# EAGLE design codeshield_complete (EAGLE 5.07)
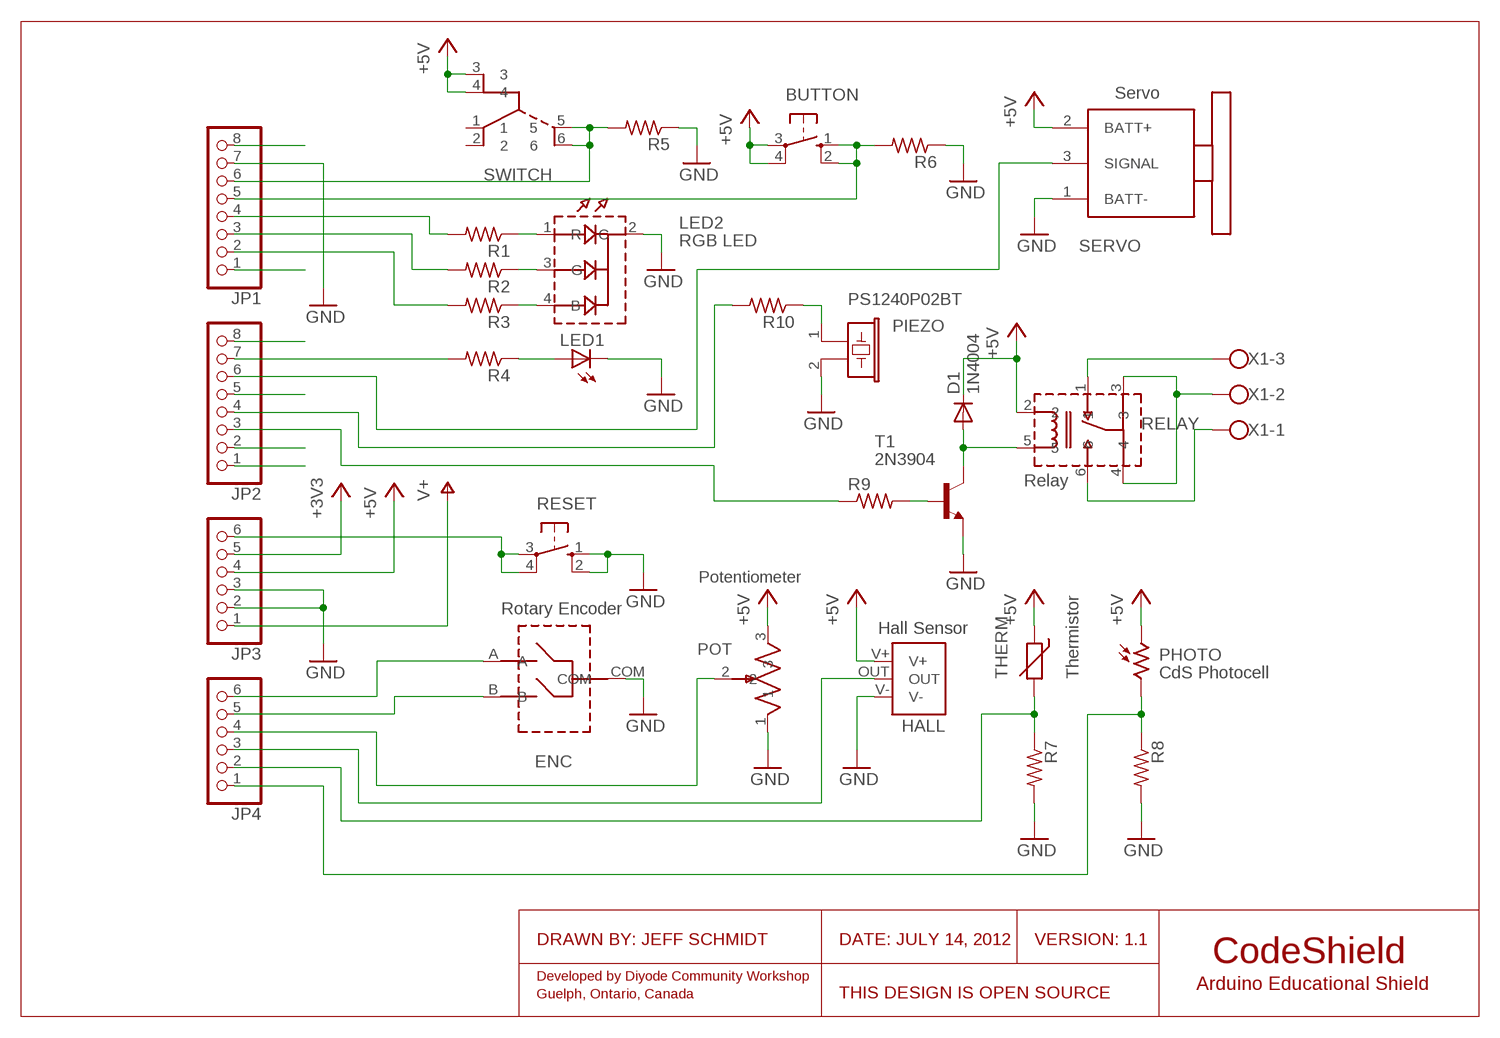
[diagram p0: schematic, sheet 1]

## Parts
BUTTON  10-XX  [B3F-10XX]
D1  1N4004  [DO41-10]
ENC  EVE_ROTARY_ENCODER  [12MM_ENCODER]
HALL  SS49E  [TO_92_SHORT]
JP1  PINHD-1X8  [1X08]
JP2  PINHD-1X8  [1X08]
JP3  PINHD-1X6  [1X06]
JP4  PINHD-1X6  [1X06]
LED1  LED5MM  [LED5MM]
LED2  RGB LED  RGBLED_COMMON_CATHODE  [RGB_VERTICAL]
PHOTO  CdS Photocell  VT20N1  [TO46-VT200]
PIEZO  PS1240P02BT  [PS1240P02BT]
POT  EVU_POTENTIOMETER  [VERT_POT]
R1  R-US_0207/10  [0207/10]
R2  R-US_0207/10  [0207/10]
R3  R-US_0207/10  [0207/10]
R4  R-US_0207/10  [0207/10]
R5  R-US_0207/10  [0207/10]
R6  R-US_0207/10  [0207/10]
R7  R-US_0207/10  [0207/10]
R8  R-US_0207/10  [0207/10]
R9  R-US_0207/10  [0207/10]
R10  R-US_0207/10  [0207/10]
RELAY  TSC_1FORMC  [TSC_RELAY]
RESET  10-XX  [B3F-10XX]
SERVO  SG90_SERVO  [SG90_SERVO]
SWITCH  MHSS_MICROSLIDE  [SLIDE_SWITCH]
T1  2N3904  [TO92]
THERM  Thermistor  THERMISTOR-5  [R-5]
X1  W237-103  [W237-103]

## Nets
+3V3: JP3.5
+5V: BUTTON.3(P) BUTTON.4(P1) D1.C HALL.V+ JP3.4 PHOTO.1 POT.3 RELAY.2 SERVO.2(BATT+) SWITCH.3 SWITCH.4 THERM.1
BLUE: JP1.3 R2.2
BUTTON: BUTTON.1(S) BUTTON.2(S1) JP1.5 R6.2
GND: ENC.COM HALL.V- JP1.7 JP3.2 JP3.3 LED1.K(C) LED2.2(C) PIEZO.2 POT.1 R5.1 R6.1 R7.2 R8.2 RESET.1(S) RESET.2(S1) SERVO.1(BATT-) T1.3(E)
GREEN: JP1.2 R3.2
HALL_SENSOR: HALL.OUT JP4.3
LED: JP2.7 R4.2
N$1: LED2.1(R) R1.1
N$2: LED2.3(G) R2.1
N$3: LED2.4(B) R3.1
N$4: PIEZO.1 R10.1
N$5: JP1.8
N$6: D1.A RELAY.5 T1.1(C)
N$7: LED1.A R4.1
N$9: RELAY.1 X1.3
N$10: RELAY.3 RELAY.4 X1.2
N$12: RELAY.6 X1.1
N$13: R9.2 T1.2(B)
PHOTOCELL: JP4.1 PHOTO.2 R8.1
PIEZO: JP2.4 R10.2
POTENTIOMETER: JP4.4 POT.2
RED: JP1.4 R1.2
RELAY: JP2.3 R9.1
RESET: JP3.6 RESET.3(P) RESET.4(P1)
ROTARY_A: ENC.A JP4.6
ROTARY_B: ENC.B JP4.5
SERVO: JP2.6 SERVO.3(SIGNAL)
SWITCH: JP1.6 R5.2 SWITCH.5 SWITCH.6
THERMISTOR: JP4.2 R7.1 THERM.2
UNUSED1: JP1.1
UNUSED2: JP2.8
UNUSED3: JP2.5
UNUSED4: JP2.2
UNUSED5: JP2.1
V+: JP3.1
Unconnected: SWITCH.1 SWITCH.2

## Notes on the sheet
- Servo
- Relay
- Potentiometer
- Rotary Encoder
- Hall Sensor
- DRAWN BY: JEFF SCHMIDT | DATE: JULY 14, 2012 | VERSION: 1.1
- CodeShield
- Developed by Diyode Community Workshop
- Arduino Educational Shield
- Guelph, Ontario, Canada | THIS DESIGN IS OPEN SOURCE

## Library data of the parts
BUTTON RESET = switch-omron:10-XX: OMRON SWITCH
D1 = diode:1N4004: DIODE general purpose rectifier, 1 A
ENC = CodeShield Parts:EVE_ROTARY_ENCODER: Panasonic EVE-series rotary encoder 12mm body, 6mm flatted end shaft Quadrature output With Detents 12 pulses per revolution
HALL = CodeShield Parts:SS49E: Honeywell SS49E series Hall Effect Sensor Sensing range: 1mV/G ~ 1.75mV/G Type: Linear Voltage: 2.7V - 6.5V Supply Current: 10mA Output: Analog
JP1 JP2 = pinhead:PINHD-1X8: PIN HEADER
JP3 JP4 = pinhead:PINHD-1X6: PIN HEADER
LED1 = led:LED: LED OSRAM: - CHIPLED LG R971, LG N971, LY N971, LG Q971, LY Q971, LO R971, LY R971 LH N974, LH R974 LS Q976, LO Q976, LY Q976 LO Q996 - Hyper CHIPLED LW Q18S LB Q993, LB Q99A, LB R99A - SideLED LS A670, LO A670, LY A670, LG A670, LP A670 LB A673, LV A673, LT A673, LW A673 LH A674 LY A675 LS A676, LA A676, LO A676, LY A676, LW A676 LS A679, LY A679, LG A679 - Hyper Micro SIDELED® LS Y876, LA Y876, LO Y876, LY Y876 LT Y87S - SmartLED LW L88C, LW L88S LB L89C, LB L89S, LG L890 LS L89K, LO L89K, LY L89K LS L896, LA L896, LO L896, LY L896 - TOPLED LS T670, LO T670, LY T670, LG T670, LP T670 LSG T670, LSP T670, LSY T670, LOP T670, LYG T670 LG T671, LOG T671, LSG T671 LB T673, LV T673, LT T673, LW T673 LH T674 LS T676, LA T676, LO T676, LY T676, LB T676, LH T676, LSB T676, LW T676 LB T67C, LV T67C, LT T67C, LS T67K, LO T67K, LY T67K, LW E67C LS E67B, LA E67B, LO E67B, LY E67B, LB E67C, LV E67C, LT E67C LW T67C LS T679, LY T679, LG T679 LS T770, LO T770, LY T770, LG T770, LP T770 LB T773, LV T773, LT T773, LW T773 LH T774 LS E675, LA E675, LY E675, LS T675 LS T776, LA T776, LO T776, LY T776, LB T776 LHGB T686 LT T68C, LB T68C - Hyper Mini TOPLED® LB M676 - Mini TOPLED Santana® LG M470 LS M47K, LO M47K, LY M47K Source: http://www.osram.convergy.de LUXEON: - LUMILED® LXK2-PW12-R00, LXK2-PW12-S00, LXK2-PW14-U00, LXK2-PW14-V00 LXK2-PM12-R00, LXK2-PM12-S00, LXK2-PM14-U00 LXK2-PE12-Q00, LXK2-PE12-R00, LXK2-PE12-S00, LXK2-PE14-T00, LXK2-PE14-U00 LXK2-PB12-K00, LXK2-PB12-L00, LXK2-PB12-M00, LXK2-PB14-N00, LXK2-PB14-P00, LXK2-PB14-Q00 LXK2-PR12-L00, LXK2-PR12-M00, LXK2-PR14-Q00, LXK2-PR14-R00 LXK2-PD12-Q00, LXK2-PD12-R00, LXK2-PD12-S00 LXK2-PH12-R00, LXK2-PH12-S00 LXK2-PL12-P00, LXK2-PL12-Q00, LXK2-PL12-R00 Source: www.luxeon.com KINGBRIGHT: KA-3528ASYC Source: www.kingbright.com
LED2 = RGB LED:RGBLED_COMMON_CATHODE: Common Cathode RGB LED mounted vertically
PHOTO = photo-elements:VT2*: Photoconductive Cell VT200 Series Source: http://optoelectronics.perkinelmer.com/content/Datasheets/DTS_vt200seriesdatasheet.pdf
PIEZO = buzzer:PS1240P02BT: TDK piezo buzzer, 5mm pin pitch, 12.2mm diameter
POT = CodeShield Parts:EVU_POTENTIOMETER: Panasonic EVU-series potentiometer 6mm flatted shaft vertical orientation
R1-R10 = rcl:R-US_: RESISTOR, American symbol
RELAY = CodeShield Parts:TSC_1FORMC: Tyco Electronics TSC-series relay. 1 FORM C topology; ON-(ON)
SERVO = CodeShield Parts:SG90_SERVO: Tower Pro SG90 9 gram servo -vertical mount -separate 3-pin header or direct solder holes -mount to PCB with 18-20mm standoffs -size compatible with HS-55
SWITCH = CodeShield Parts:MHSS_MICROSLIDE: APEM MHSS series micro slide switch. Vertical orientation
T1 = transistor:2N3904: NPN TRANSISTOR
THERM = varistor:THERMISTOR: THERMISTOR
X1 = con-wago-500:W237-103: WAGO SCREW CLAMP

## Board
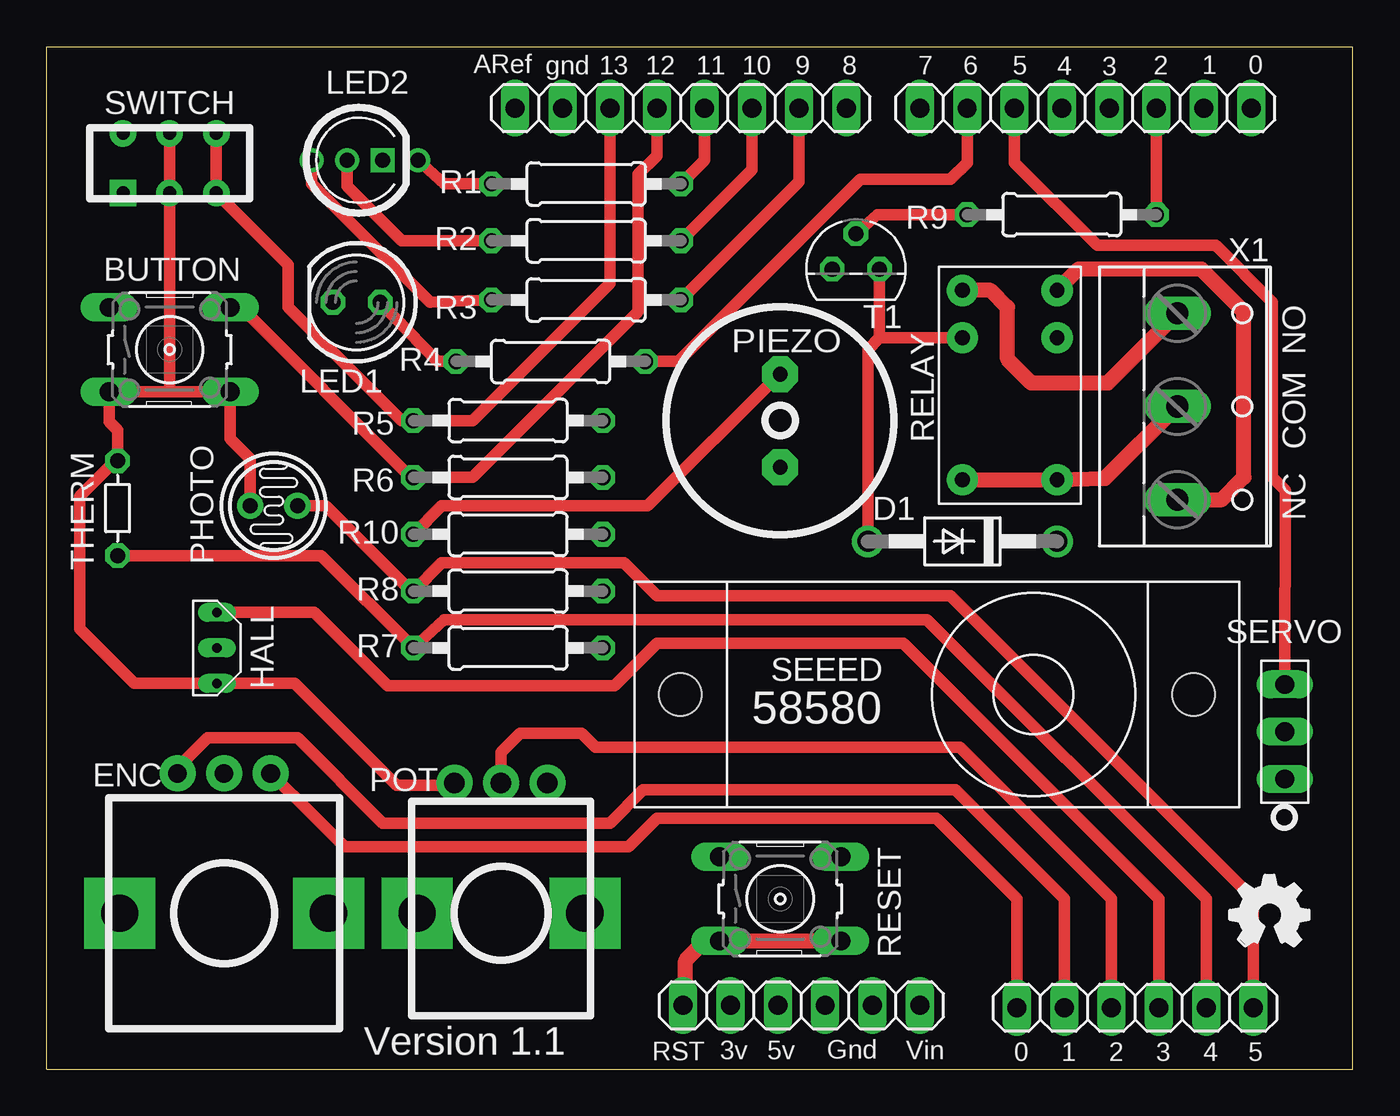
[diagram p1: board, top side]
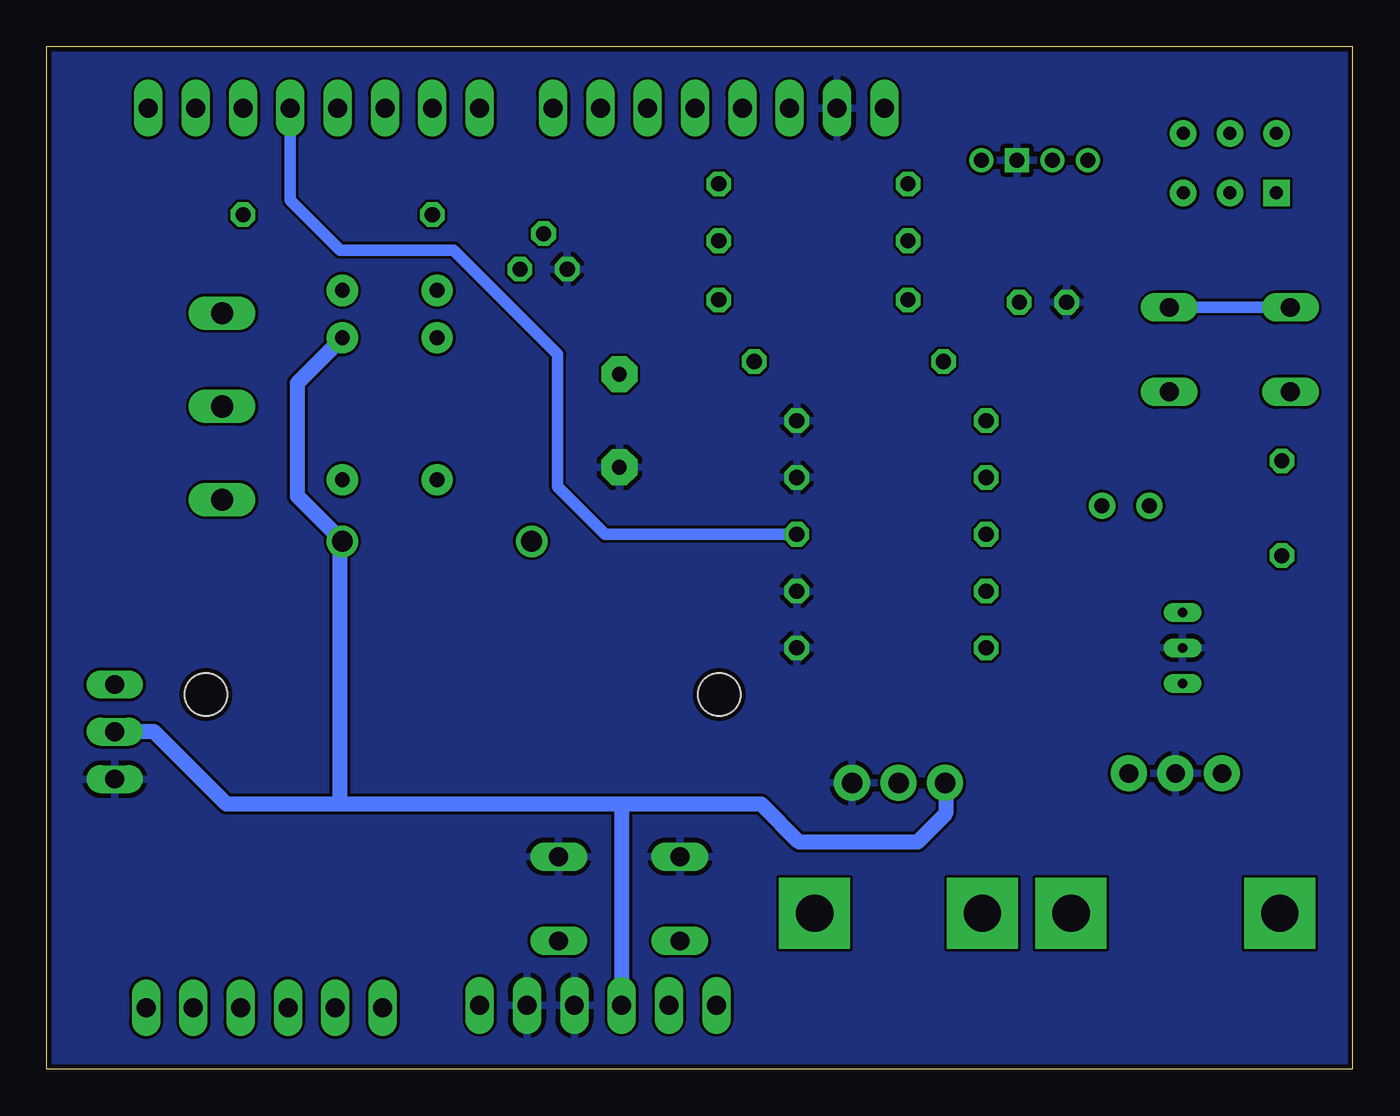
[diagram p2: board, bottom side, seen from below]

Size 70.1 x 54.86 mm. Coordinates in mm from the lower left corner, seen from the top.
Outline: 0,0 70.1,0 70.1,54.86 0,54.86 0,0
Copper layers (1*16): Top 0.035mm / dielectric 1.5mm / Bottom 0.035mm
Design rules: minimum track width 6mil, minimum drill 12mil, track to track 6mil, track to pad 6mil, pad to pad 6mil, via to via 6mil, smd to smd 0mil, copper to edge 10mil, drill to drill 10mil, minimum pad ring 10mil, minimum via ring 6mil, stop-mask expansion 2mil, vias tented up to drill 100mil, thermal gap 10mil

### Footprints (pad centres in the part's own frame; a part is rotated, then mirrored left to right if it is on the bottom)
B3F-10XX = drill 1.016 long: 1 -3.251,2.261; 2 3.251,2.261; 3 -3.251,-2.261; 4 3.251,-2.261
DO41-10 = drill 1.118: A 5.08,0; C -5.08,0
12MM_ENCODER = drill 1 pad 1.93: A -2.5,0; B 2.5,0; COM 0,0 | drill 2 pad 3.81 square: P$4 5.6,7.5; P$5 -5.6,7.5
TO_92_SHORT = drill 0.5 long: OUT 1.905,0; V+ -1.905,0; V- 0,0
1X08 = drill 1.016 long: 1 -8.89,0; 2 -6.35,0; 3 -3.81,0; 4 -1.27,0; 5 1.27,0; 6 3.81,0; 7 6.35,0; 8 8.89,0
1X06 = drill 1.016 long: 1 -6.35,0; 2 -3.81,0; 3 -1.27,0; 4 1.27,0; 5 3.81,0; 6 6.35,0
LED5MM = drill 0.813 octagon: A -1.27,0; K 1.27,0
RGB_VERTICAL = drill 0.8: 1 3.81,0; 3 0,0; 4 -1.905,0 | drill 0.8 square: 2 1.905,0
TO46-VT200 = drill 0.8 pad 1.4: 1 -1.27,0; 2 1.27,0
PS1240P02BT = drill 0.8 pad 1.93 octagon: 1 -2.5,0; 2 2.5,0
VERT_POT = drill 1.1 pad 1.93: 1 -2.5,0; 2 0,0; 3 2.5,0 | drill 2 pad 3.81 square: P$4 -4.5,7; P$5 4.5,7
0207/10 = drill 0.813 octagon: 1 -5.08,0; 2 5.08,0
TSC_RELAY = drill 0.8 pad 1.676: 1 -5.08,2.54; 2 -2.54,2.54; 3 5.08,2.54; 4 5.08,-2.54; 5 -2.54,-2.54; 6 -5.08,-2.54
SG90_SERVO = drill 1 long: 1 -2.44,10.59; 2 -2.44,8.05; 3 -2.44,5.51 | hole 2.3: 2.45,6.05; 30,6.05
SLIDE_SWITCH = drill 0.7 pad 1.422 square: 1 -1.5,2.5 | drill 0.7 pad 1.422: 2 1.7,2.5; 3 -1.5,0; 4 1.7,0; 5 -1.5,-2.5; 6 1.7,-2.5
TO92 = drill 0.813 octagon: 1 1.27,0; 2 0,1.905; 3 -1.27,0
R-5 = drill 0.813 octagon: 1 -2.54,0; 2 2.54,0
W237-103 = drill 1.194 long: 1 -5,-1.29; 2 0,-1.29; 3 5,-1.29

### Placement (x,y rotation side)
BUTTON  6.6,38.61 0 top
D1  49.15,28.32 180 top
ENC  9.53,15.88 180 top
HALL  9.14,22.61 90 top
JP1  34.04,51.56 180 top
JP2  55.75,51.56 180 top
JP3  40.51,3.43 180 top
JP4  58.42,3.3 180 top
LED1  16.64,41.15 180 top
LED2  16.13,48.77 0 top
PHOTO  12.19,30.23 0 top
PIEZO  39.37,34.8 270 top
POT  24.38,15.37 180 top
R1  28.96,47.5 0 top
R2  28.96,44.45 0 top
R3  28.96,41.27 0 top
R4  27.05,37.97 0 top
R5  24.77,34.8 180 top
R6  24.77,31.75 180 top
R7  24.77,22.61 0 top
R8  24.77,25.65 0 top
R9  54.48,45.85 180 top
R10  24.77,28.7 0 top
RELAY  51.69,36.7 270 top
RESET  39.37,9.14 0 top
SERVO  64.01,26.16 180 top
SWITCH  6.6,48.51 90 top
T1  43.43,42.93 0 top
THERM  3.81,30.1 270 top
U$1  [OSHW_FILLX150_NOTEXT]  63.5,6.6 0 top
X1  61.98,35.56 270 top

### Tracks (layer width: path | path; a pad name or v marks a point on that pad's centre or on a via)
+5V
  Top 0.61: POT.3 21.76,15.24 18.8,15.24 13.31,20.7 HALL.V+ 4.7,20.7 1.78,23.62 1.78,30.73 3.68,32.64 THERM.1 3.81,34.29 3.35,34.75 BUTTON.3 6.63,36.35 | BUTTON.4 9.86,33.83 10.92,32.77 PHOTO.1 | BUTTON.4 9.12,36.35 | 6.63,36.35 BUTTON.4 | 6.63,36.35 6.6,36.37 SWITCH.3 SWITCH.4
  Bottom 0.61: 54.36,28.19 D1.C | POT.3 21.84,15.33
  Bottom 0.813: D1.C 56.64,30.73 56.64,36.83 RELAY.2 | 54.36,14.22 60.45,14.22 64.34,18.11 SERVO.2 | 54.36,14.22 54.36,28.19 | 21.84,15.33 21.84,13.72 23.37,12.19 29.72,12.19 31.75,14.22 39.37,14.22 | 39.37,14.22 54.36,14.22 | JP3.4 39.24,14.1 39.37,14.22
BLUE
  Top 0.61: R2.2 37.85,48.26 JP1.3
BUTTON
  Top 0.61: JP1.5 32.77,49.02 31.75,48.01 31.75,40.64 22.86,31.75 R6.2 19.3,32 10.44,40.87 BUTTON.2
  Bottom 0.61: BUTTON.1 BUTTON.2
GND
  pour Bottom: 0,54.86 69.98,54.86 69.98,0 0,0
GREEN
  Top 0.61: JP1.2 40.39,47.62 R3.2
HALL_SENSOR
  Top 0.61: JP4.3 59.69,9.14 45.97,22.86 32.77,22.86 30.48,20.57 18.29,20.57 14.35,24.51 HALL.OUT
LED
  Top 0.61: R4.2 33.91,37.97 43.69,47.75 48.51,47.75 49.4,48.64 JP2.7
N$1
  Top 0.61: LED2.1 21.34,47.5 R1.1
N$2
  Top 0.61: LED2.3 16.13,47.37 19.05,44.45 R2.1
N$3
  Top 0.61: LED2.4 14.22,47.5 20.57,41.15 R3.1
N$4
  Top 0.61: PIEZO.1 39.33,37.3 32.26,30.23 21.21,30.23 R10.1
N$6
  Top 0.61: 44.7,39.24 T1.1 | 44.7,39.24 44.07,38.61 D1.A | 44.7,39.24 RELAY.5
N$7
  Top 0.61: LED1.A 20.95,37.97 R4.1
N$9
  Top 0.813: RELAY.1 55.37,42.93 61.98,42.93 64.26,40.64 64.26,31.75 63.07,30.56 X1.3
N$10
  Top 0.813: RELAY.4 RELAY.3 56.79,31.7 X1.2
N$12
  Top 0.813: RELAY.6 50.67,41.78 51.56,40.89 51.56,38.1 52.83,36.83 56.96,36.83 X1.1
N$13
  Top 0.61: R9.2 44.58,45.85 T1.2
PHOTOCELL
  Top 0.61: JP4.1 64.77,9.14 48.51,25.4 32.77,25.4 30.99,27.18 21.21,27.18 R8.1 19.56,25.65 14.99,30.23 PHOTO.2
PIEZO
  Bottom 0.61: R10.2 40.13,28.7 42.67,31.24 42.67,38.35 48.26,43.94 54.36,43.94 57.02,46.61 JP2.4
POTENTIOMETER
  Top 0.61: POT.2 24.38,17.02 25.4,18.03 28.7,18.03 29.46,17.27 49.02,17.27 57.15,9.14 JP4.4
RED
  Top 0.61: R1.2 35.31,48.77 JP1.4
RELAY
  Top 0.61: R9.1 JP2.3
RESET
  Top 0.813: RESET.4 RESET.3 35.33,6.88 34.29,5.84 34.29,3.56 JP3.6
ROTARY_A
  Top 0.61: ENC.A 14.31,13.63 16,11.94 31.24,11.94 32.77,13.46 47.75,13.46 52.07,9.14 JP4.6
ROTARY_B
  Top 0.61: ENC.B 7.03,16.17 8.64,17.78 13.46,17.78 18.03,13.21 30.23,13.21 32,14.99 48.77,14.99 54.61,9.14 JP4.5
SERVO
  Top 0.61: JP2.6 51.94,48.64 56.39,44.2 62.74,44.2 65.79,41.15 65.79,31.75 66.47,31.07 SERVO.3
SWITCH
  Top 0.61: JP1.6 30.23,42.16 22.86,34.8 R5.2 19.05,34.8 12.95,40.89 12.95,43.16 SWITCH.5 SWITCH.6
THERMISTOR
  Top 0.61: JP4.2 62.23,9.14 47.24,24.13 21.34,24.13 R7.1 14.73,27.56 THERM.2

### Text on the board
tPlace: ARef | gnd | 13 | 12 | 11 | 10 | 9 | 8 | 7 | 6 | 5 | 4 | 3 | 2 | 1 | 0 | 3v | 5v | Gnd | Vin | RST | 0 | 1 | 2 | 3 | 4 | 5
tNames: NO | COM | NC | SEEED | 58580 | Version 1.1
Reference: 2.65" | 2.16" | 2.75"